# EAGLE design HomeAutomationModule (EAGLE 8.2.1)
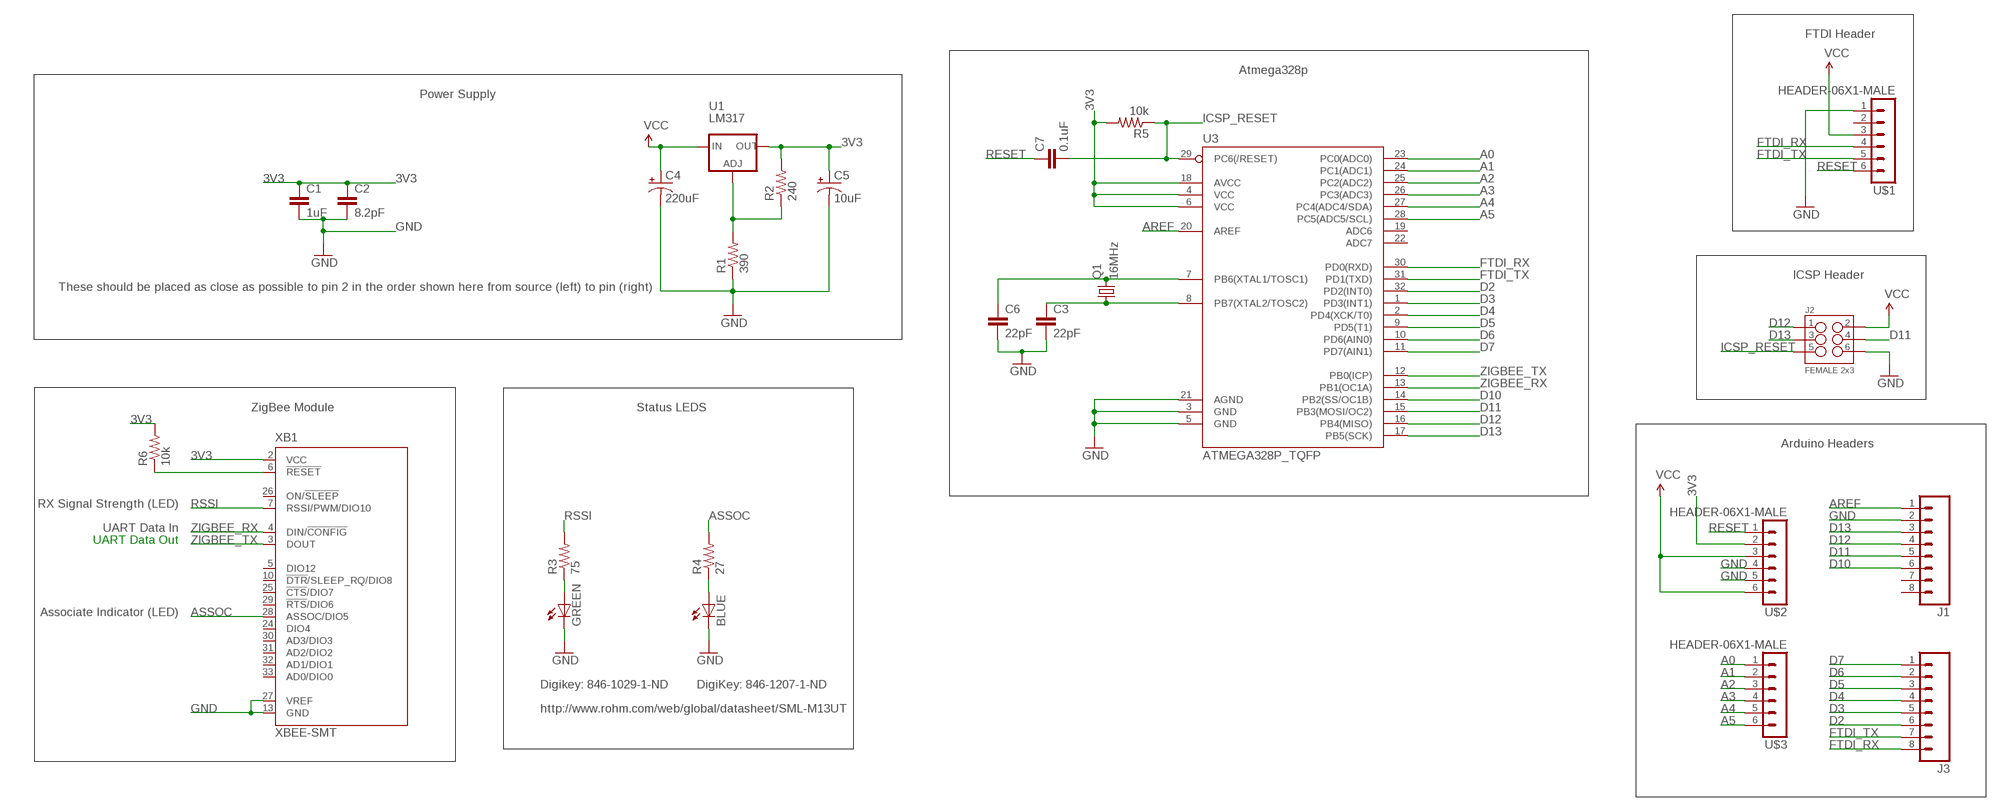
[diagram p0: schematic, sheet 1]

## Parts
BLUE  LEDCHIP-LED0805  [CHIP-LED0805]
C1  1uF  1.0UF-25V-+80/-20(0805)"  [0805-CAP]
C2  8.2pF  1.0UF-25V-+80/-20(0805)"  [0805-CAP]
C3  22pF  2.2UF-25V-+80/-20(0805)  [0805-CAP]
C4  220uF  CAP_POLPTH2  [CPOL-RADIAL-10UF-25V]
C5  10uF  CAP_POLPTH2  [CPOL-RADIAL-10UF-25V]
C6  22pF  2.2UF-25V-+80/-20(0805)  [0805-CAP]
C7  0.1uF  2.2UF-25V-+80/-20(0805)  [0805-CAP]
GREEN  LEDCHIP-LED0805  [CHIP-LED0805]
J1  M08  [1X08_ROUND]
J2  FEMALE 2x3  M03X2FEMALE  [2X3]
J3  M08  [1X08_ROUND]
Q1  16MHz  CRYSTALHC49S  [HC49/S]
R1  390  RESISTOR0805-RES  [0805]
R2  240  RESISTOR0805-RES  [0805]
R3  75  RESISTOR0805-RES  [0805]
R4  27  RESISTOR0805-RES  [0805]
R5  10k  RESISTOR0805-RES  [0805]
R6  10k  RESISTOR0805-RES  [0805]
U1  LM317  V_REG_317SMD  [SOT223]
U3  ATMEGA328P_TQFP  [TQFP32-08]
U$1  HEADER-06X1-MALE  [06X1-PTH]
U$2  HEADER-06X1-MALE  [06X1-PTH]
U$3  HEADER-06X1-MALE  [06X1-PTH]
XB1  XBEE-SMT  [XBEE-SMT]

## Nets
3V3: C1.1 C2.1 C5.1(+) R2.2 R5.2 R6.2 U1.2(OUT) U3.4(VCC) U3.6(VCC) U3.18(AVCC) U$2.2 XB1.2(VCC)
A0: U3.23(PC0(ADC0)) U$3.1
A1: U3.24(PC1(ADC1)) U$3.2
A2: U3.25(PC2(ADC2)) U$3.3
A3: U3.26(PC3(ADC3)) U$3.4
A4: U3.27(PC4(ADC4/SDA)) U$3.5
A5: U3.28(PC5(ADC5/SCL)) U$3.6
AREF: J1.1 U3.20(AREF)
ASSOC: R4.2 XB1.28(ASSOC/DIO5)
D2: J3.6 U3.32(PD2(INT0))
D3: J3.5 U3.1(PD3(INT1))
D4: J3.4 U3.2(PD4(XCK/T0))
D5: J3.3 U3.9(PD5(T1))
D6: J3.2 U3.10(PD6(AIN0))
D7: J3.1 U3.11(PD7(AIN1))
D10: J1.6 U3.14(PB2(SS/OC1B))
D11: J1.5 J2.4 U3.15(PB3(MOSI/OC2))
D12: J1.4 J2.1 U3.16(PB4(MISO))
D13: J1.3 J2.3 U3.17(PB5(SCK))
FTDI_RX: J3.8 U3.30(PD0(RXD)) U$1.4
FTDI_TX: J3.7 U3.31(PD1(TXD)) U$1.5
GND: BLUE.C C1.2 C2.2 C3.2 C4.2(-) C5.2(-) C6.2 GREEN.C J1.2 J2.6 R1.1 U3.3(GND) U3.5(GND) U3.21(AGND) U$1.1 U$2.4 U$2.5 XB1.13(GND) XB1.27(VREF)
ICSP_RESET: C7.2 J2.5 R5.1 U3.29(PC6(/RESET))
N$1: BLUE.A R4.1
N$3: R6.1 XB1.6(!RESET)
N$4: C6.1 Q1.2 U3.7(PB6(XTAL1/TOSC1))
N$5: C3.1 Q1.1 U3.8(PB7(XTAL2/TOSC2))
N$7: R1.2 R2.1 U1.1(ADJ)
N$8: GREEN.A R3.1
RESET: C7.1 U$1.6 U$2.1
RSSI: R3.2 XB1.7(RSSI/PWM/DIO10)
VCC: C4.1(+) J2.2 U1.3(IN) U$1.3 U$2.3 U$2.6
ZIGBEE_RX: U3.13(PB1(OC1A)) XB1.4(DIN/!CONFIG)
ZIGBEE_TX: U3.12(PB0(ICP)) XB1.3(DOUT)
Unconnected: J1.7 J1.8 U3.19(ADC6) U3.22(ADC7) U$1.2 XB1.5(DIO12) XB1.10(!DTR!/SLEEP_RQ/DIO8) XB1.24(DIO4) XB1.25(!CTS!/DIO7) XB1.26(ON/!SLEEP) XB1.29(!RTS!/DIO6) XB1.30(AD3/DIO3) XB1.31(AD2/DIO2) XB1.32(AD1/DIO1) XB1.33(AD0/DIO0)

## Notes on the sheet
- FTDI Header
- Atmega328p
- Power Supply
- ICSP Header
- These should be placed as close as possible to pin 2 in the order shown here from source (left) to pin (right)
- ZigBee Module | Status LEDS
- Arduino Headers
- RX Signal Strength (LED)
- UART Data In
- UART Data Out
- Associate Indicator (LED)
- Digikey: 846-1029-1-ND | DigiKey: 846-1207-1-ND
- http://www.rohm.com/web/global/datasheet/SML-M13UT

## Library data of the parts
BLUE GREEN = adafruit:LED: LED OSRAM: - CHIPLED LG R971, LG N971, LY N971, LG Q971, LY Q971, LO R971, LY R971 LH N974, LH R974 LS Q976, LO Q976, LY Q976 LO Q996 - Hyper CHIPLED LW Q18S LB Q993, LB Q99A, LB R99A - SideLED LS A670, LO A670, LY A670, LG A670, LP A670 LB A673, LV A673, LT A673, LW A673 LH A674 LY A675 LS A676, LA A676, LO A676, LY A676, LW A676 LS A679, LY A679, LG A679 - Hyper Micro SIDELED® LS Y876, LA Y876, LO Y876, LY Y876 LT Y87S - SmartLED LW L88C, LW L88S LB L89C, LB L89S, LG L890 LS L89K, LO L89K, LY L89K LS L896, LA L896, LO L896, LY L896 - TOPLED LS T670, LO T670, LY T670, LG T670, LP T670 LSG T670, LSP T670, LSY T670, LOP T670, LYG T670 LG T671, LOG T671, LSG T671 LB T673, LV T673, LT T673, LW T673 LH T674 LS T676, LA T676, LO T676, LY T676, LB T676, LH T676, LSB T676, LW T676 LB T67C, LV T67C, LT T67C, LS T67K, LO T67K, LY T67K, LW E67C LS E67B, LA E67B, LO E67B, LY E67B, LB E67C, LV E67C, LT E67C LW T67C LS T679, LY T679, LG T679 LS T770, LO T770, LY T770, LG T770, LP T770 LB T773, LV T773, LT T773, LW T773 LH T774 LS E675, LA E675, LY E675, LS T675 LS T776, LA T776, LO T776, LY T776, LB T776 LHGB T686 LT T68C, LB T68C - Hyper Mini TOPLED® LB M676 - Mini TOPLED Santana® LG M470 LS M47K, LO M47K, LY M47K Source: http://www.osram.convergy.de/
C1 C2 = SparkFun-Capacitors:1.0UF-25V-+80/-20(0805): CAP-11625; PROD_ID: CAP-11625; VALUE: 1.0uF
C3 C6 C7 = SparkFun-Capacitors:2.2UF-25V-+80/-20(0805): CAP-11624; PROD_ID: CAP-11624; VALUE: 2.2uF
C4 C5 = SparkFun-Capacitors:CAP_POL: Capacitor Polarized These are standard SMD and PTH capacitors. Normally 10uF, 47uF, and 100uF in electrolytic and tantalum varieties. Always verify the external diameter of the through hole cap, it varies with capacity, voltage, and manufacturer. The EIA devices should be standard.
J1 J3 = SparkFun-Connectors:M08: Header 8 Standard 8-pin 0.1" header. Use with straight break away headers (SKU : PRT-00116), right angle break away headers (PRT-00553), swiss pins (PRT-00743), machine pins (PRT-00117), and female headers (PRT-00115).; PROD_ID: CONN-08437
J2 = SparkFun-Connectors:M03X2: 2x3 .1" header. Shrouded, with keying- CONN-10681 SMT- CONN-11415 Pogo pins- HW-11044; PROD_ID: CONN-11566
Q1 = adafruit:CRYSTAL: CRYSTAL; OC_FARNELL: 1667008; OC_NEWARK: unknown
R1-R6 = SparkFun-Passives:RESISTOR: Resistor Basic schematic elements and footprints for 0603, 1206, and PTH resistors.
U1 = SparkFun-PowerIC:V_REG_317: Voltage Regulator Standard LM317 adjustable voltage regulator. AOI (Adjust Output Input). Google 'LM317 Calculator' for easy to use app to get the two resistor values needed. 240/720 for 5V output. 240/390 for 3.3V output. Spark Fun Electronics SKU : COM-00527
U3 = SparkFun-DigitalIC:ATMEGA328P_TQFP; PROD_ID: IC-09069
U$1-U$3 = GeekAmmo:HEADER-06X1?: 6 x 0.1 inch Header 40x1 0.1inch Male Breakaway header can be used. - 4UCON 00834 <http://www.4uconnector.com/online/SearchPro.asp?FormName=ProSearch&FormAction=search&s_GroupNo=&s_keyword=00834> For female part, if possible use 6 x 1 without breaking.; OTHER: 4UCON 00834; URL: http://www.4uconnector.com/online/SearchPro.asp?FormName=ProSearch&FormAction=search&s_GroupNo=&s_keyword=00834
XB1 = xbee:XBEE-SMT: XBee(TM)/XBee-PRO(TM) ZB SMT RF Modules. Source: Digi (90002002_a.pdf) (http://www.digi.com/products/wireless-wired-embedded-solutions/zigbee-rf-modules/zigbee-mesh-module/xbee-smt.jsp#overview)

## Board
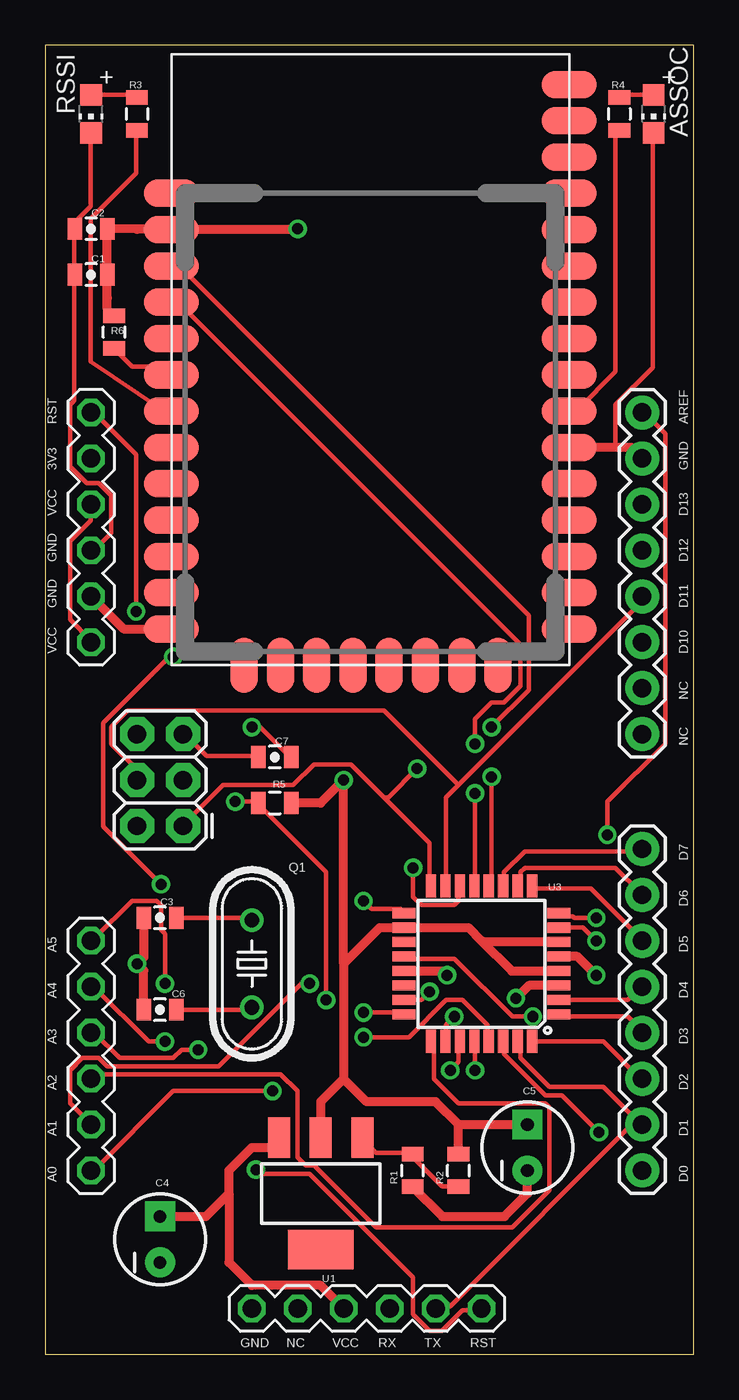
[diagram p1: board, top side]
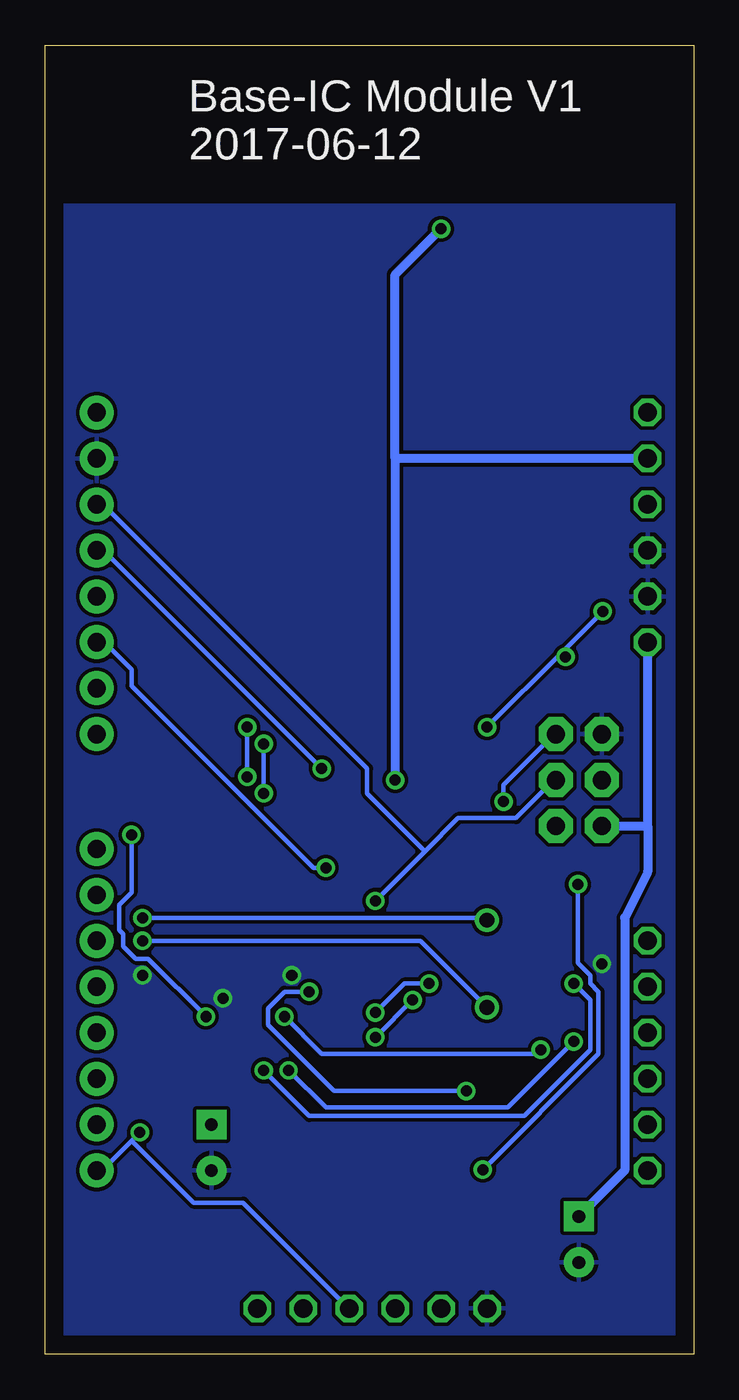
[diagram p2: board, bottom side, seen from below]

Size 35.87 x 72.38 mm. Coordinates in mm from the lower left corner, seen from the top.
Outline: 0,0 35.87,0 35.87,72.38 0,72.38 0,0
Copper layers (1*16): Top 0.035mm / dielectric 1.5mm / Bottom 0.035mm
Design rules "default": minimum track width 10mil, minimum drill 24mil, track to track 8mil, track to pad 8mil, pad to pad 8mil, via to via 8mil, smd to smd 8mil, copper to edge 40mil, drill to drill 8mil, minimum pad ring 10mil, minimum via ring 8mil, stop-mask expansion 4mil, vias tented up to drill 0mil, thermal gap 10mil

### Footprints (pad centres in the part's own frame; a part is rotated, then mirrored left to right if it is on the bottom)
CHIP-LED0805 = smd 1.2 x 1.2: A 0,-1.05; C 0,1.05
0805-CAP = smd 0.8 x 1.2: 1 -0.9,0; 2 0.9,0
CPOL-RADIAL-10UF-25V = drill 0.7 pad 1.651 square: 1 1.27,0 | drill 0.7 pad 1.651: 2 -1.27,0
1X08_ROUND = drill 1.016 pad 1.88: 1 0,0; 2 2.54,0; 3 5.08,0; 4 7.62,0; 5 10.16,0; 6 12.7,0; 7 15.24,0; 8 17.78,0
2X3 = drill 1.016 pad 1.88 octagon: 1 0,0; 2 0,2.54; 3 2.54,0; 4 2.54,2.54; 5 5.08,0; 6 5.08,2.54
HC49/S = drill 0.813: 1 -2.413,0; 2 2.413,0
0805 = smd 0.8 x 1.2: 1 -0.9,0; 2 0.9,0
SOT223 = smd 1.219 x 2.235: 1 -2.311,-3.099; 2 0,-3.099; 3 2.311,-3.099 | smd 3.6 x 2.2: 4 0,3.099
TQFP32-08 = smd 1.27 x 0.559: 1 -4.293,2.8; 2 -4.293,2; 3 -4.293,1.2; 4 -4.293,0.4; 5 -4.293,-0.4; 6 -4.293,-1.2; 7 -4.293,-2; 8 -4.293,-2.8; 17 4.293,-2.8; 18 4.293,-2; 19 4.293,-1.2; 20 4.293,-0.4; 21 4.293,0.4; 22 4.293,1.2; 23 4.293,2; 24 4.293,2.8 | smd 0.559 x 1.27: 9 -2.8,-4.293; 10 -2,-4.293; 11 -1.2,-4.293; 12 -0.4,-4.293; 13 0.4,-4.293; 14 1.2,-4.293; 15 2,-4.293; 16 2.8,-4.293; 25 2.8,4.293; 26 2,4.293; 27 1.2,4.293; 28 0.4,4.293; 29 -0.4,4.293; 30 -1.2,4.293; 31 -2,4.293; 32 -2.8,4.293
06X1-PTH = drill 1.016 octagon: 1 -6.35,0; 2 -3.81,0; 3 -1.27,0; 4 1.27,0; 5 3.81,0; 6 6.35,0
XBEE-SMT = smd 3.048 x 1.524: 1 0,26.086; 2 0,24.079; 3 0,22.073; 4 0,20.066; 5 0,18.059; 6 0,16.053; 7 0,14.046; 8 0,12.04; 9 0,10.033; 10 0,8.026; 11 0,6.02; 12 0,4.013; 13 0,2.007; 22 21.996,2.007; 23 21.996,4.013; 24 21.996,6.02; 25 21.996,8.026; 26 21.996,10.033; 27 21.996,12.04; 28 21.996,14.046; 29 21.996,16.053; 30 21.996,18.059; 31 21.996,20.066; 32 21.996,22.073; 33 21.996,24.079; 34 21.996,26.086; 35 21.996,28.092; 36 21.996,30.099; 37 21.996,32.106 | smd 1.524 x 3.048: 14 4.013,0; 15 6.02,0; 16 8.026,0; 17 10.033,0; 18 12.04,0; 19 14.046,0; 20 16.053,0; 21 18.059,0

### Placement (x,y rotation side)
BLUE  33.66,68.58 180 top
C1  2.54,59.69 180 top
C2  2.54,62.23 180 top
C3  6.35,24.13 180 top
C4  6.35,6.35 90 top
C5  26.67,11.43 90 top
C6  6.35,19.05 180 top
C7  12.7,33.02 180 top
GREEN  2.54,68.58 180 top
J1  33.02,52.07 270 top
J2  7.62,29.21 90 top
J3  33.02,27.94 270 top
Q1  11.43,21.59 270 top
R1  20.32,10.16 90 top
R2  22.86,10.16 90 top
R3  5.08,68.58 270 top
R4  31.75,68.58 270 top
R5  12.7,30.48 0 top
R6  3.81,56.52 90 top
U1  15.24,8.89 180 top
U3  24.13,21.59 180 top
U$1  17.78,2.54 0 top
U$2  2.54,45.72 270 top
U$3  2.54,16.51 90 top
XB1  6.99,38.1 0 top

### Tracks (layer width: path | path; a pad name or v marks a point on that pad's centre or on a via)
3V3  (via drill 0.61)
  Top 0.254: 24.2,22.79 24.13,22.86 | v13.97,62.23 13.92,62.18 | XB1.2 6.96,62.21 | 13.97,30.48 R5.2 | R6.2 3.44,57.79
  Top 0.508: U3.4 25.8,21.19 24.13,22.86 23.4,23.59 U3.18 18.51,23.59 16.51,21.59 | U3.6 24.2,22.79 | 22.86,12.7 21.59,13.97 17.78,13.97 16.51,15.24 | 16.51,21.59 v16.51,31.75 15.24,30.48 13.97,30.48 | 16.51,15.24 15.24,13.97 U1.2 | 16.51,21.59 16.51,15.24 | 13.92,62.18 XB1.2 | 6.96,62.21 5.08,62.21 C2.1 C1.1 3.44,58.42 3.44,57.79 | R2.2 22.86,12.7 | 22.86,12.7 C5.1
  Bottom 0.508: 16.51,49.53 v16.51,31.75 | 16.51,49.53 16.51,59.69 v13.97,62.23 | U$2.2 16.51,49.53
A0  (via drill 0.61)
  Top 0.254: v21.26,20.04 20.8,19.58 19.89,19.58 U3.23 | v12.57,14.55 7.09,14.55 2.74,10.21 U$3.1
  Bottom 0.254: v21.26,20.04 22.63,20.04 23.55,19.13 23.55,18.21 19.89,14.55 v12.57,14.55
A1  (via drill 0.61)
  Top 0.254: v17.6,18.9 19.66,18.9 U3.24 | v14.63,20.5 14.17,20.5 9.6,15.93 3.43,15.93 2.97,16.38 2.06,16.38 1.37,15.7 1.37,13.87 U$3.2
  Bottom 0.254: v17.6,18.9 16,20.5 v14.63,20.5
A2
  Top 0.254: U3.25 21.49,17.3 21.49,15.24 22.86,13.87 27.66,13.87 27.89,13.64 27.89,9.07 25.83,7.01 18.29,7.01 14.86,10.44 14.4,10.44 13.95,10.9 13.95,14.55 13.03,15.47 2.97,15.47 2.74,15.24 U$3.3
A3  (via drill 0.61)
  Top 0.254: v22.63,18.67 22.17,18.21 22.17,17.3 U3.26 | v8.46,16.84 7.54,16.84 7.09,16.38 4.12,16.38 2.74,17.75 U$3.4
  Bottom 0.254: v22.63,18.67 20.57,16.61 8.69,16.61 v8.46,16.84
A4  (via drill 0.61)
  Top 0.254: v22.4,15.7 22.86,16.15 22.86,17.3 U3.27 | v6.63,17.3 5.71,17.3 2.74,20.27 U$3.5
  Bottom 0.254: v22.4,15.7 20.34,13.64 10.29,13.64 v6.63,17.3
A5  (via drill 0.61)
  Top 0.254: v23.77,15.7 23.77,17.3 U3.28 | v6.63,20.5 6.63,23.24 6.4,23.47 6.4,24.84 6.17,25.07 4.8,25.07 2.74,23.01 U$3.6
  Bottom 0.254: v23.77,15.7 21.26,13.18 9.37,13.18 5.71,16.84 5.71,19.58 v6.63,20.5
AREF  (via drill 0.61)
  Top 0.254: v26.98,18.67 25.83,18.67 22.63,21.87 19.89,21.87 U3.20 | v31.09,28.73 31.09,30.56 34.29,33.76 34.29,50.9 33.15,52.05 J1.1
  Bottom 0.254: v26.98,18.67 30.18,21.87 30.86,21.87 31.55,22.55 31.55,23.24 31.77,23.47 31.77,24.84 31.09,25.53 v31.09,28.73
ASSOC
  Top 0.254: R4.2 31.55,67.59 31.55,54.33 29.49,52.27 29.03,52.27 XB1.28
D2
  Top 0.254: U3.32 30.86,17.3 32.92,15.24 J3.6
D3
  Top 0.254: U3.1 28.57,18.67 32.23,18.67 32.92,17.98 J3.5
D4
  Top 0.254: U3.2 28.57,19.58 32.23,19.58 32.92,20.27 J3.4
D5
  Top 0.254: U3.9 26.98,25.76 30.18,25.76 32.92,23.01 J3.3
D6
  Top 0.254: U3.10 26.29,25.98 26.29,26.67 26.52,26.9 31.55,26.9 32.92,25.53 J3.2
D7
  Top 0.254: U3.11 25.38,25.98 25.38,26.67 26.52,27.81 32.92,27.81 J3.1
D10  (via drill 0.61)
  Top 0.254: v20.34,26.9 20.34,25.3 20.8,24.84 22.63,24.84 22.86,25.07 22.86,25.76 U3.14
  Bottom 0.254: v20.34,26.9 21.03,26.9 31.09,36.96 31.09,37.87 32.46,39.24 32.92,39.24 J1.6
D11
  Top 0.254: 22.86,31.47 33.15,41.76 J1.5 | 22.86,31.47 22.17,30.79 22.17,25.98 U3.15 | 22.86,31.47 18.75,35.59 4.57,35.59 3.66,34.67 3.66,33.76 5.03,32.39 5.03,31.93 J2.4
D12  (via drill 0.61)
  Top 0.254: 18.75,30.79 16.92,32.61 14.86,32.61 13.72,31.47 9.83,31.47 7.77,29.41 J2.1 | 18.75,30.79 21.26,28.27 21.26,25.98 U3.16 | v20.57,32.39 18.97,30.79 18.75,30.79
  Bottom 0.254: v20.57,32.39 32.46,44.27 32.92,44.27 J1.4
D13  (via drill 0.61)
  Top 0.254: v17.6,25.07 18.06,24.61 19.66,24.61 U3.17
  Bottom 0.254: 14.86,27.81 13.03,29.64 9.83,29.64 7.77,31.7 J2.3 | 14.86,27.81 v17.6,25.07 | 14.86,27.81 18.06,31.01 18.06,32.39 32.46,46.79 32.92,46.79 J1.3
FTDI_RX  (via drill 0.61)
  Top 0.254: v30.63,12.27 28.57,14.33 27.66,14.33 25.38,16.61 25.38,17.3 U3.30
  Bottom 0.254: 31.09,11.81 32.92,9.98 J3.8 | 31.09,11.81 v30.63,12.27 | 31.09,11.81 27.66,8.38 24.92,8.38 19.2,2.67 U$1.4
FTDI_TX
  Top 0.254: 32.69,12.95 32.92,12.72 J3.7 32.69,12.95 | 32.69,12.95 30.86,14.78 27.89,14.78 26.29,16.38 26.29,17.3 U3.31 | 32.69,12.95 22.4,2.67 21.72,2.67 U$1.5
GND  (via drill 0.61)
  Top 0.254: GREEN.C 2.52,67.36 2.52,63.48 1.83,62.79 1.83,62.33 C2.2 1.6,62.1 1.6,59.82 C1.2 1.6,59.59 1.6,52.73 1.37,52.5 1.37,49.07 2.29,48.16 2.97,48.16 3.66,47.47 3.66,45.41 2.74,44.5 U$2.4 | 31.55,50.14 31.55,52.5 33.6,54.56 33.6,67.36 BLUE.C
  Top 0.508: U3.3 26.74,20.39 v26.04,19.68 | U3.21 21.99,21.19 v22.23,20.95 | J1.2 32.41,50.14 31.55,50.14 XB1.27 | U$2.5 4.34,40.11 XB1.13 | v30.48,20.95 29.45,21.99 U3.5 | R1.1 21.96,7.62 25.4,7.62 26.67,8.89 C5.2 | C3.2 5.45,21.96 v5.08,21.59 5.45,21.22 C6.2
  pour Bottom: 35.56,63.5 0,63.5 0,0 35.56,0
ICSP_RESET  (via drill 0.61)
  Top 0.254: v10.52,30.56 11.66,30.56 R5.1 11.89,30.33 15.54,26.67 v15.54,19.58 | C7.2 11.66,33.07 8.91,33.07 7.77,34.21 J2.5 | v17.6,17.53 20.12,17.53 22.17,19.58 23.09,19.58 24.46,18.21 24.46,17.3 U3.29
  Bottom 0.254: v10.52,30.56 10.52,31.47 7.77,34.21 J2.5 | v15.54,19.58 v17.6,17.53
N$1
  Top 0.254: R4.1 31.77,69.65 33.6,69.65 BLUE.A
N$3
  Top 0.254: XB1.6 6.99,54.61 4.82,54.61 R6.1
N$4  (via drill 0.61)
  Top 0.254: v30.48,22.86 29.75,23.59 U3.7 | Q1.2 11.3,19.05 C6.1
  Bottom 0.254: Q1.2 15.11,22.86 v30.48,22.86
N$5  (via drill 0.61)
  Top 0.254: U3.8 28.61,24.2 29.19,24.2 29.26,24.13 v30.48,24.13 | Q1.1 11.3,24.13 C3.1
  Bottom 0.254: Q1.1 11.56,24.13 v30.48,24.13
N$7
  Top 0.254: U1.1 17.6,11.81 18.29,11.12 20.12,11.12 R1.2 20.34,10.9 21.95,9.3 22.86,9.3 R2.1
N$8
  Top 0.254: R3.1 5.03,69.65 2.74,69.65 GREEN.A
RESET  (via drill 0.61)
  Top 0.254: v11.43,34.67 11.89,34.67 13.49,33.07 C7.1 | v5.03,41.07 5.03,49.76 2.74,52.05 U$2.1 | v11.66,10.21 11.89,9.98 14.63,9.98 20.34,4.27 20.34,2.21 21.26,1.29 21.95,1.29 23.09,2.44 24,2.44 U$1.6 | v6.4,25.98 3.2,29.18 3.2,34.9 6.86,38.56 v7.09,38.56
  Bottom 0.254: v5.03,41.07 7.32,38.79 | 7.32,38.79 v11.43,34.67 | v11.66,10.21 5.26,16.61 5.26,20.04 5.71,20.5 5.71,20.95 6.4,21.64 v6.4,25.98 | 7.32,38.79 v7.09,38.56
RSSI
  Top 0.254: R3.2 5.03,67.59 5.03,65.3 2.52,62.79 2.52,54.89 6.4,52.27 6.86,52.27 XB1.7
VCC
  Top 0.254: 12.37,11.43 U1.3 | U$2.3 2.52,46.79 2.52,46.1 1.37,44.96 1.37,40.62 2.52,39.47 U$2.6
  Top 0.508: U$1.3 15.24,3.81 11.43,3.81 10.16,5.08 10.16,8.89 | 10.16,8.89 10.16,10.16 11.43,11.43 12.37,11.43 | C4.1 8.89,7.62 10.16,8.89
  Bottom 0.508: 2.54,29.21 U$2.6 | 2.54,29.21 2.54,26.67 3.81,24.13 3.81,10.16 C4.1 | J2.2 2.54,29.21
ZIGBEE_RX  (via drill 0.61)
  Top 0.254: v23.77,31.01 23.77,25.98 U3.13 | v23.77,33.76 23.77,35.13 24.69,36.04 25.38,36.04 26.29,36.96 26.29,39.24 7.54,57.99 7.09,57.99 XB1.4
  Bottom 0.254: v23.77,33.76 v23.77,31.01
ZIGBEE_TX  (via drill 0.61)
  Top 0.254: v24.69,31.93 24.69,25.98 U3.12 | v24.69,34.67 26.75,36.73 26.75,40.84 7.54,60.05 7.09,60.05 XB1.3
  Bottom 0.254: v24.69,34.67 v24.69,31.93

### Text on the board
tNames: RSSI | ASSOC | RST | AREF | 3V3 | GND | VCC | D13 | GND | D12 | GND | D11 | VCC | D10 | NC | NC | D7 | D6 | A5 | D5 | A4 | D4 | A3 | D3 | A2 | D2 | A1 | D1 | A0 | D0 | GND | NC | VCC | RX | TX | RST
bNames: Base-IC Module V1 / 2017-06-12